# Altium schematic sheet sd_card.SchDoc
size B
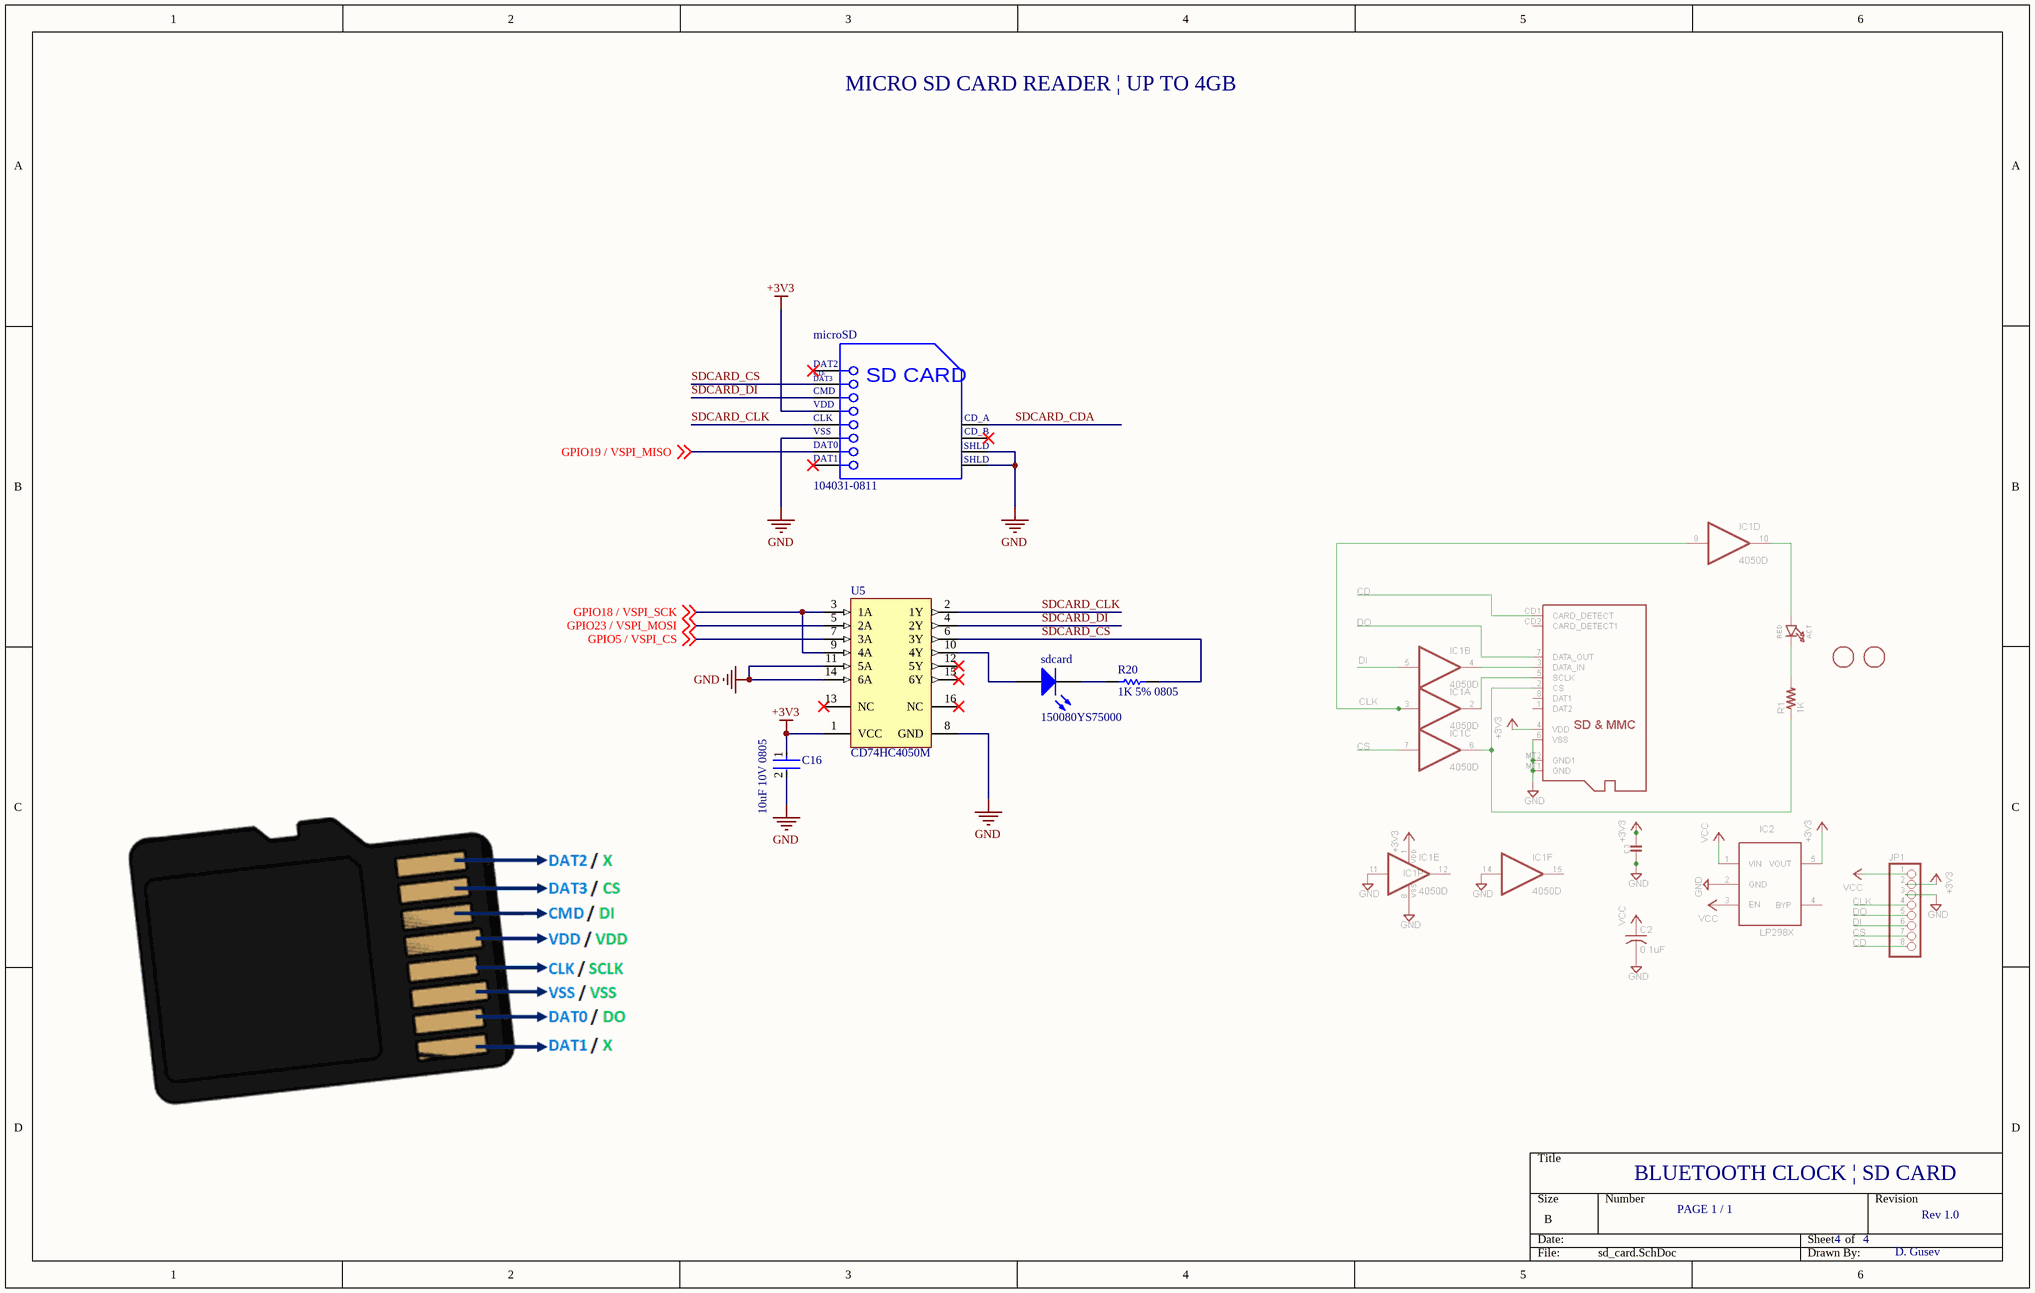
[diagram p0: sd_card.SchDoc]

## Parts
C16  10uF 10V 0805  [FP-C0805C-DG-MFG]
microSD  104031-0811  [MOLX-104031-0811_V]
R20  1K 5% 0805  [RESC2013X60X40ML20T25]
sdcard  150080YS75000  [0805_A]
U5  CD74HC4050M  [D0016A_M]

## Nets
+3V3: C16.1 microSD.4(VDD) U5.1(VCC)
GND: C16.2 microSD.6(VSS2) microSD.11(SHLD1) microSD.12(SHLD2) U5.8(GND) U5.11(5A) U5.14(6A)
GPIO5 / VSPI_CS: U5.7(3A) ; off-sheet GPIO5 / VSPI_CS
GPIO18 / VSPI_SCK: U5.3(1A) U5.9(4A) ; off-sheet GPIO18 / VSPI_SCK
GPIO19 / VSPI_MISO: microSD.7(DAT0) ; off-sheet GPIO19 / VSPI_MISO
GPIO23 / VSPI_MOSI: U5.5(2A) ; off-sheet GPIO23 / VSPI_MOSI
SDCARD_CDA: microSD.9(CD_A)
SDCARD_CLK: microSD.5(CLK) U5.2(1Y)
SDCARD_CS: microSD.2(CMD) R20.2 U5.6(3Y)
SDCARD_DI: microSD.3(VSS1) U5.4(2Y)
NetR20_1: R20.1 sdcard.1(K)
Netsdcard_2: sdcard.2(A) U5.10(4Y)

Not connected (* = marked no-connect by the designer): microSD 1(CD/DAT3)* 8(DAT1)* 10(CD_B)*; U5 12(5Y)* 13(NC)* 15(6Y)* 16(NC)*

## Notes on the sheet
- MICRO SD CARD READER | UP TO 4GB
- BLUETOOTH CLOCK | SD CARD
- PAGE 1 / 1
- 4
- Rev 1.0
- D. Gusev
- (in symbol CMP-2000-05825-1) DAT2; CD/; DAT3; SD CARD; VSS; SHLD

## Library data of the parts
C16 = CMP-2007-03243-2: CAP CER 10UF 10V X5R 0805; Manufacturer Part Number: C0805C106K8PACTU; Manufacturer: Kemet; 3DS Part Number: 220-00001; Tolerance: 10%; Temperature Coefficient: 15%; Material: Ceramic; Device Class L2: Capacitors; Device Class L1: Passive Components; ComponentLink2URL: https://content.kemet.com/datasheets/KEM_C1006_X5R_SMD.pdf; Height: 1.4mm; Lead Free: Yes; Digikey Description: CAP CER 10UF 10V X5R 0805; Octopart: https://octopart.com/c0805c106k8pactu-kemet-98697; Capacitance: 10uF; Value: 10uF; Temperature Range Low: -55°C; Temperature: -55°C to +85°C; Automotive: No; Mouser Description: CAP CER 10UF 10V X5R 0805; Ipc Land Pattern Name: CAPC200125X125; Temperature Range High: +85°C; Voltage: 10V; RoHS: TRUE; Device Class L3: Ceramic Capacitors; ComponentLink2Description: Datasheet; Voltage Rating: 10V; Package: C0805C-DG; Temperature Characteristic: X5R; Category: Cap
microSD = CMP-2000-05825-1: Micro SD Card, RA, -25 to 85 degC, 8-Pin SMD, RoHS, Tape and Reel; Voltage Rating: 10VAC/DC; Number of Contacts: 8; Insertion - Extraction Style: Push-Pull; Pitch: 1.1mm; Mating Cycles: 10000; Brand: Molex; Current Rating: 500mA; Manufacturer URL: http://www.molex.com/; Card Type: microSD; Mounting Type: Standard; Height: 1.42mm; Mounting Technology: SurfaceMount; Contact Plating: Gold; Product Category: MemoryCardConnectors; Package Description: 8-Pin Surface Mount Device, Body 11.95 x 11.4 mm, Pitch 1.1 mm; Datasheet URL: http://www.molex.com/pdm_docs/sd/1040310811_sd.pdf; Termination Style: SMD; Length: 11.4mm; Housing Material: LiquidCrystalPolymer(LCP); Orientation: RightAngle; RoHS: True; Contact Material: PhosphorBronze; Datasheet Version: Rev. E, 04/2006; Packaging: Reel; Manufacturer: Molex; Series: 104031; Product: CardConnectors; Number of Rows: 1Row; Package Reference: 104031-0811
R20 = CMP-2001-00590-1: Part Number: ERA6AEB123V; Manufacturer: Panasonic
sdcard = CMP-1426-00012-1: SMD mono-color Chip LED, WL-SMCW, Yellow; Manufacturer: Wuerth Elektronik; Color: Yellow; ComponentLink1URL: http://www.we-online.com; PackageReference: 0805_A; ComponentLink2URL: http://katalog.we-online.com/led/datasheet/150080YS75000.pdf; ComponentLink1Description: Manufacturer URL; ComponentLink2Description: Datasheet; PartNumber: 150080YS75000
U5 = CMP-0440-00356-3: High Speed CMOS Logic Hex Non-Inverting Buffers, D0016A, TUBE; Manufacturer: Texas Instruments; F @ Nom Voltage(Max)(Mhz): 28; Voltage(Nom)(V): 6; VCC(Min)(V): 2; tpd @ Nom Voltage(Max)(ns): 18; ICC @ Nom Voltage(Max)(mA): 0.02; Rating: Catalog; PackageReference: D0016A; DatasheetVersion: SCHS205I; Output Type: CMOS; Operating Temperature Range(C): -55 to 125; Bits(#): 6; VCC(Max)(V): 6; PackageVersion: http://www.ti.com/lit/ml/mpds178g/mpds178g.pdf; Input Type: CMOS; Generic Part Number: CD74HC4050; Code_JEDEC: MS-012 variation AC